# Altium schematic sheet Main1.SchDoc
size A3
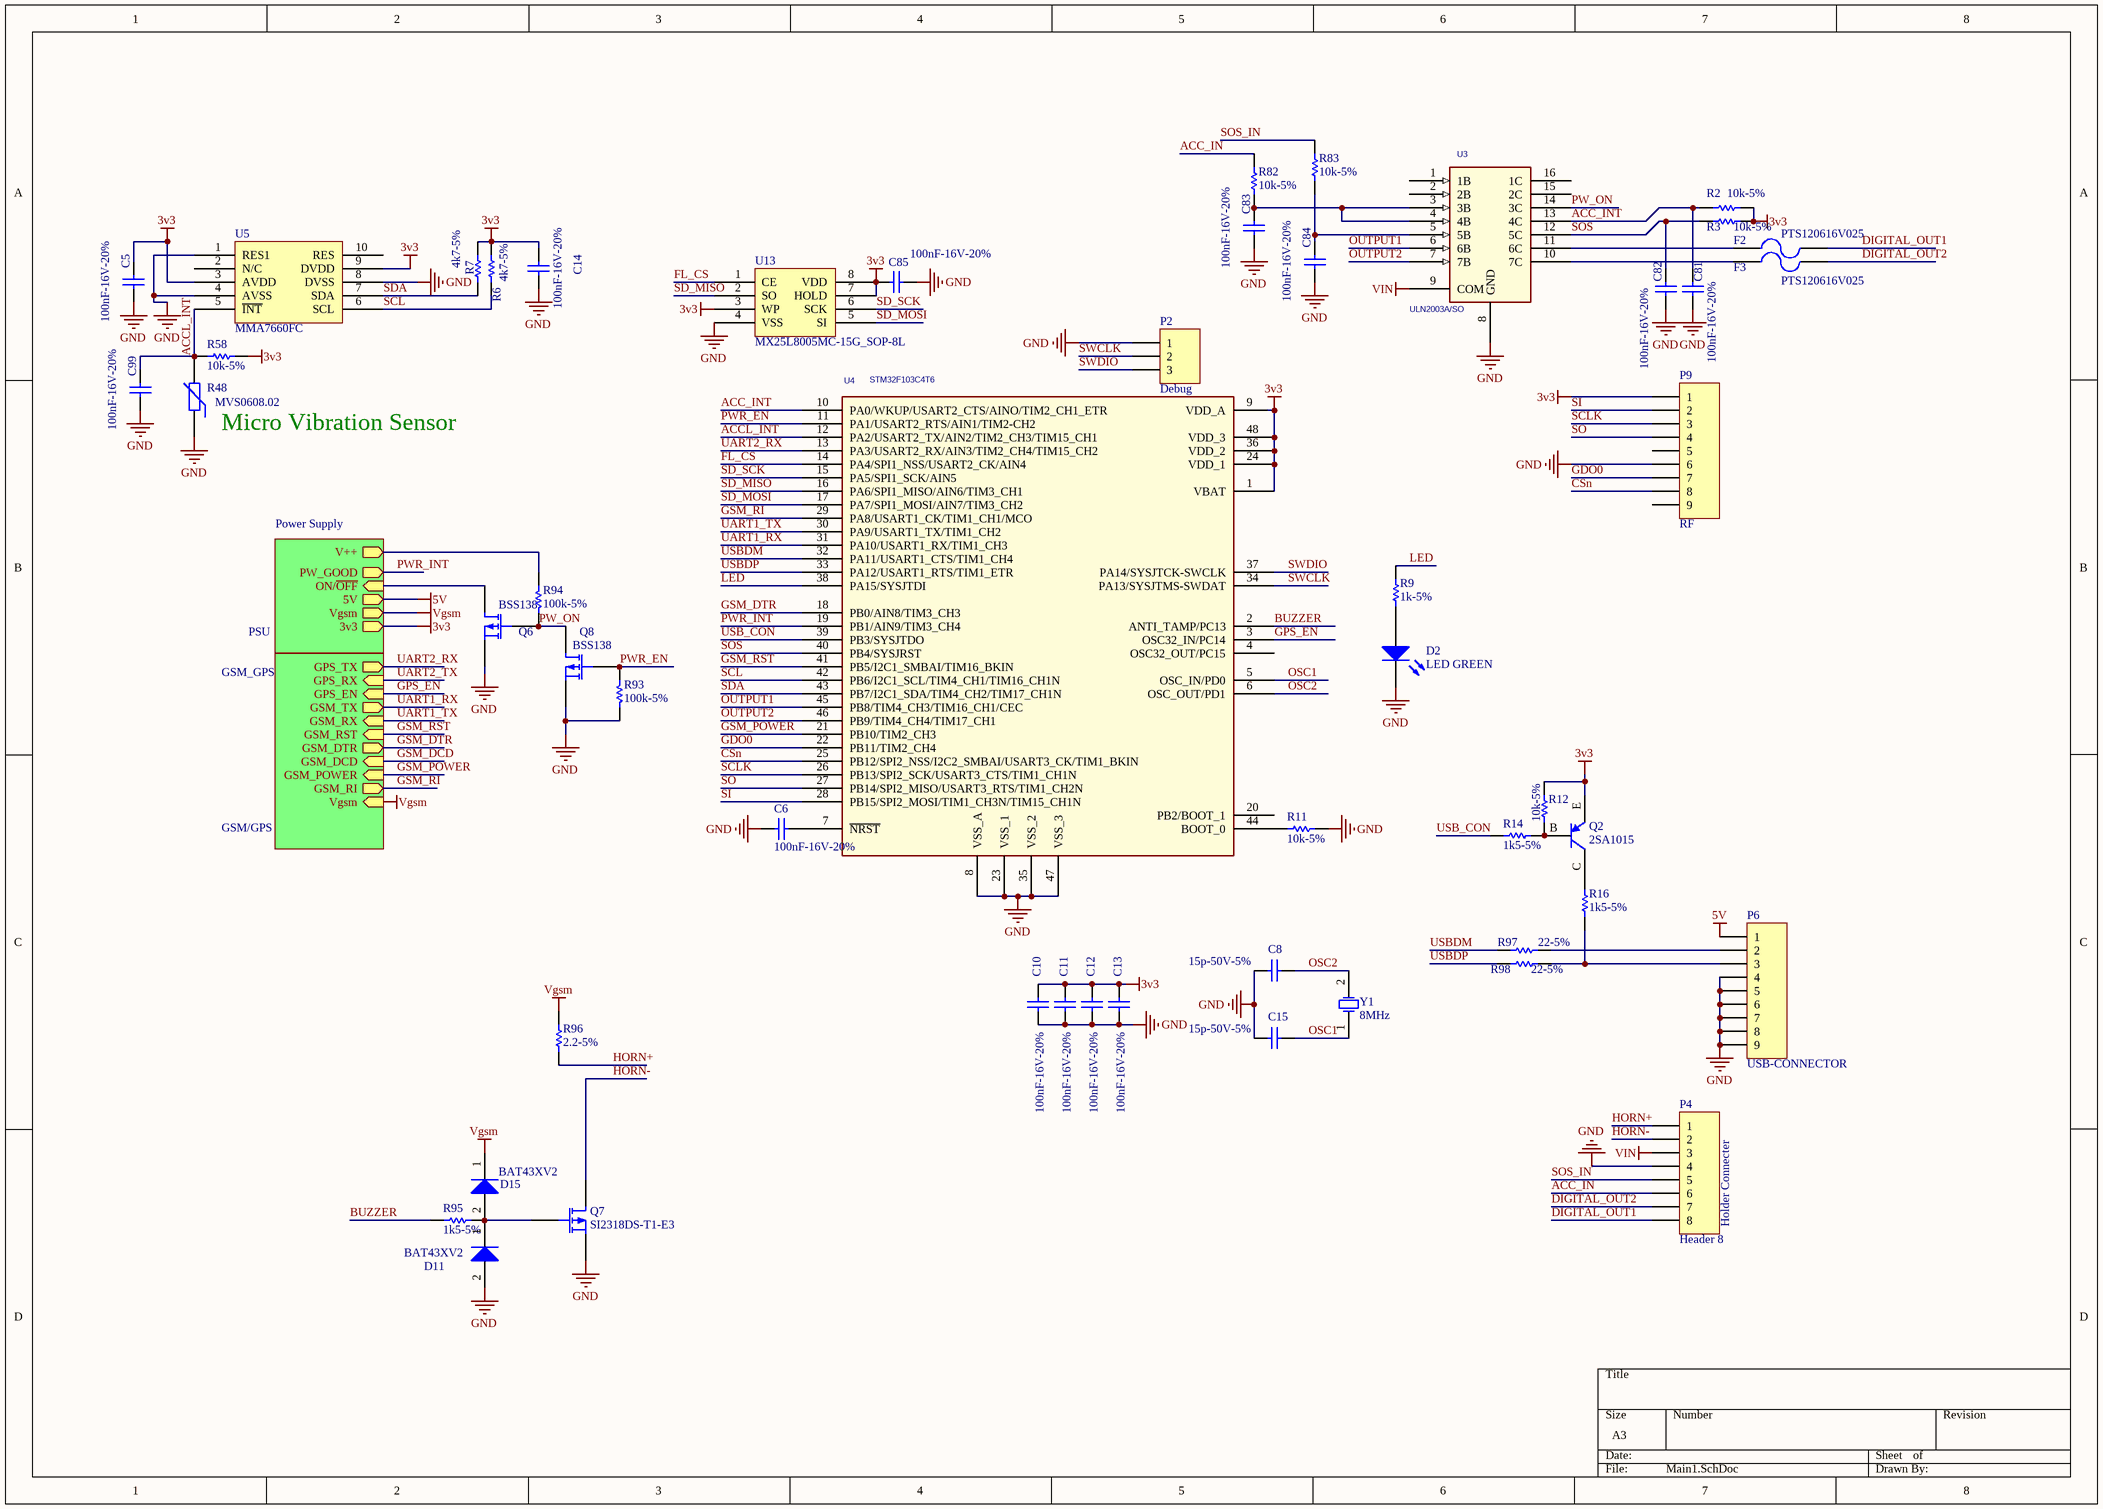
[diagram p0: Main1.SchDoc]

## Parts
C5  100nF-16V-20%  [C0402]
C6  100nF-16V-20%  [C0402]
C8  15p-50V-5%  [C0402]
C10  100nF-16V-20%  [C0402]
C11  100nF-16V-20%  [C0402]
C12  100nF-16V-20%  [C0402]
C13  100nF-16V-20%  [C0402]
C14  100nF-16V-20%  [C0402]
C15  15p-50V-5%  [C0402]
C81  100nF-16V-20%  [C0402]
C82  100nF-16V-20%  [C0402]
C83  100nF-16V-20%  [C0402]
C84  100nF-16V-20%  [C0402]
C85  100nF-16V-20%  [C0402]
C99  100nF-16V-20%  [C0402]
D2  LED GREEN  [LED0603-G]
D11  BAT43XV2  [BAT43XV2]
D15  BAT43XV2  [BAT43XV2]
F2  PTS120616V025  [PTC1206]
F3  PTS120616V025  [PTC1206]
P2  Debug  [HDR1X3]
P4  Header 8  [HDR1X8]
P6  USB-CONNECTOR  [USB MINI B RECEPTACLE-M]
P9  RF  [CC2500]
Q2  2SA1015  [SC-43-BCE]
Q6  BSS138  [SOT23-3]
Q7  SI2318DS-T1-E3  [SOT23-3]
Q8  BSS138  [SOT23-3]
R2  10k-5%  [R0402]
R3  10k-5%  [R0402]
R6  4k7-5%  [R0402]
R7  4k7-5%  [R0402]
R9  1k-5%  [R0402]
R11  10k-5%  [R0402]
R12  10k-5%  [R0402]
R14  1k5-5%  [R0402]
R16  1k5-5%  [R0402]
R48  MVS0608.02  [R1210]
R58  10k-5%  [R0402]
R82  10k-5%  [R0402]
R83  10k-5%  [R0402]
R93  100k-5%  [R0402]
R94  100k-5%  [R0402]
R95  1k5-5%  [R0402]
R96  2.2-5%  [R0805]
R97  22-5%  [R0402]
R98  22-5%  [R0402]
U3  ULN2003A/SO  [SO16-150mil]
U4  STM32F103C4T6  [TQFP-48-P0.5]
U5  MMA7660FC  [MMA7660FC]
U13  MX25L8005MC-15G_SOP-8L  [SO8-150mil]
Y1  8MHz  [HC49/US-SMD]

## Sub-sheets
GSM/GPS = GSM_GPS: GSM_POWER (in), GSM_RX (in), GSM_TX (out), GSM_DTR (out), Vgsm (in), GPS_RX (in), GPS_TX (out), GSM_DCD (in), GSM_RI (out), GPS_EN (in), GSM_RST (in)
Power Supply = PSU: Vgsm (out), 3v3 (out), 5V (out), ON/~{OFF} (in), PW_GOOD (out), V++ (out)

## Nets
3v3: C5.2 C10.1 C11.1 C12.1 C13.1 C14.2 C85.1 P9.1 Q2.E R2.2 R3.2 R6.2 R7.2 R12.2 R58.2 U4.1(VBAT) U4.9(VDD_A) U4.24(VDD_1) U4.36(VDD_2) U4.48(VDD_3) U5.3(AVDD) U5.9(DVDD) U13.3(WP) U13.7(HOLD) U13.8(VDD) ; sheet Power Supply/3v3
5V: P6.1 ; sheet Power Supply/5V
GND: C5.1 C6.2 C8.1 C10.2 C11.2 C12.2 C13.2 C14.1 C15.1 C81.1 C82.1 C83.1 C84.1 C85.2 C99.1 D2.2(K) D11.2(A) P2.1 P4.4 P6.4 P6.5 P6.6 P6.7 P6.8 P6.9 P9.6 Q6.2(S) Q7.2(S) Q8.2(S) R11.1 R48.1 R93.2 U3.8(GND) U4.8(VSS_A) U4.23(VSS_1) U4.35(VSS_2) U4.47(VSS_3) U5.1(RES1) U5.4(AVSS) U5.8(DVSS) U13.4(VSS)
Vgsm: D15.1(K) R96.1 ; sheet Power Supply/Vgsm, sheet GSM/GPS/Vgsm
VIN: P4.3 U3.9(COM)
ACC_IN: P4.6 R82.2
ACC_INT: C81.2 R2.1 U3.13(4C) U4.10(PA0/WKUP/USART2_CTS/AINO/TIM2_CH1_ETR)
ACCL_INT: C99.2 R48.2 R58.1 U4.12(PA2/USART2_TX/AIN2/TIM2_CH3/TIM15_CH1) U5.5(~{INT})
BUZZER: R95.2 U4.2(ANTI_TAMP/PC13)
CSn: P9.8 U4.25(PB12/SPI2_NSS/I2C2_SMBAI/USART3_CK/TIM1_BKIN)
DIGITAL_OUT1: F2.1 P4.8
DIGITAL_OUT2: F3.1 P4.7
FL_CS: U4.14(PA4/SPI1_NSS/USART2_CK/AIN4) U13.1(CE)
GDO0: P9.7 U4.22(PB11/TIM2_CH4)
GPS_EN: U4.3(OSC32_IN/PC14) ; sheet GSM/GPS/GPS_EN
GSM_DCD: sheet GSM/GPS/GSM_DCD
GSM_DTR: U4.18(PB0/AIN8/TIM3_CH3) ; sheet GSM/GPS/GSM_DTR
GSM_POWER: U4.21(PB10/TIM2_CH3) ; sheet GSM/GPS/GSM_POWER
GSM_RI: U4.29(PA8/USART1_CK/TIM1_CH1/MCO) ; sheet GSM/GPS/GSM_RI
GSM_RST: U4.41(PB5/I2C1_SMBAI/TIM16_BKIN) ; sheet GSM/GPS/GSM_RST
HORN+: P4.1 R96.2
HORN-: P4.2 Q7.3(D)
LED: R9.2 U4.38(PA15/SYSJTDI)
OSC1: C15.2 U4.5(OSC_IN/PD0) Y1.1(OSC1)
OSC2: C8.2 U4.6(OSC_OUT/PD1) Y1.2(OSC2)
OUTPUT1: U3.6(6B) U4.45(PB8/TIM4_CH3/TIM16_CH1/CEC)
OUTPUT2: U3.7(7B) U4.46(PB9/TIM4_CH4/TIM17_CH1)
PW_ON: Q6.1(G) Q8.3(D) R94.2 U3.14(3C)
PWR_EN: Q8.1(G) R93.1 U4.11(PA1/USART2_RTS/AIN1/TIM2-CH2)
PWR_INT: U4.19(PB1/AIN9/TIM3_CH4) ; sheet Power Supply/PW_GOOD
SCL: R6.1 U4.42(PB6/I2C1_SCL/TIM4_CH1/TIM16_CH1N) U5.6(SCL)
SCLK: P9.3 U4.26(PB13/SPI2_SCK/USART3_CTS/TIM1_CH1N)
SD_MISO: U4.16(PA6/SPI1_MISO/AIN6/TIM3_CH1) U13.2(SO)
SD_MOSI: U4.17(PA7/SPI1_MOSI/AIN7/TIM3_CH2) U13.5(SI)
SD_SCK: U4.15(PA5/SPI1_SCK/AIN5) U13.6(SCK)
SDA: R7.1 U4.43(PB7/I2C1_SDA/TIM4_CH2/TIM17_CH1N) U5.7(SDA)
SI: P9.2 U4.28(PB15/SPI2_MOSI/TIM1_CH3N/TIM15_CH1N)
SO: P9.4 U4.27(PB14/SPI2_MISO/USART3_RTS/TIM1_CH2N)
SOS: C82.2 R3.1 U3.12(5C) U4.40(PB4/SYSJRST)
SOS_IN: P4.5 R83.2
SWCLK: P2.2 U4.34(PA13/SYSJTMS-SWDAT)
SWDIO: P2.3 U4.37(PA14/SYSJTCK-SWCLK)
UART1_RX: U4.31(PA10/USART1_RX/TIM1_CH3) ; sheet GSM/GPS/GSM_TX
UART1_TX: U4.30(PA9/USART1_TX/TIM1_CH2) ; sheet GSM/GPS/GSM_RX
UART2_RX: U4.13(PA3/USART2_RX/AIN3/TIM2_CH4/TIM15_CH2) ; sheet GSM/GPS/GPS_TX
UART2_TX: sheet GSM/GPS/GPS_RX
USB_CON: R14.2 U4.39(PB3/SYSJTDO)
USBDM: R97.1 U4.32(PA11/USART1_CTS/TIM1_CH4)
USBDP: R98.1 U4.33(PA12/USART1_RTS/TIM1_ETR)
NetC6_1: C6.1 U4.7(~{NRST})
NetC83_2: C83.2 R82.1 U3.3(3B) U3.4(4B)
NetC84_2: C84.2 R83.1 U3.5(5B)
NetD2_1: D2.1(A) R9.1
NetD11_1: D11.1(K) D15.2(A) Q7.1(G) R95.1
NetF2_2: F2.2 U3.11(6C)
NetF3_2: F3.2 U3.10(7C)
NetP6_2: P6.2 R97.2
NetP6_3: P6.3 R16.2 R98.2
NetQ2_B: Q2.B R12.1 R14.1
NetQ2_C: Q2.C R16.1
NetQ6_3: Q6.3(D) ; sheet Power Supply/ON/~{OFF}
NetR11_2: R11.2 U4.44(BOOT_0)
NetR94_1: R94.1 ; sheet Power Supply/V++

Not connected (* = marked no-connect by the designer): P9 5 9; U3 1(1B) 2(2B) 15(2C) 16(1C); U4 4(OSC32_OUT/PC15) 20(PB2/BOOT_1); U5 2(N/C) 10(RES)

## Notes on the sheet
- (near R48) Micro Vibration Sensor
- (near P4) Holder Connecter

## Library data of the parts
C5 C6 C10-C14 C81-C85 C99 = Cap: CAP CER 0.1UF 16V Y5V 0402; Manufacturer: Yageo; Manufacturer Part Number: CC0402ZRY5V7BB104; Published: 8-Jun-2000; LatestRevisionDate: 17-Jul-2002; LatestRevisionNote: Re-released for DXP Platform.; PackageReference: C0402; Publisher: Altium Limited; Value: 100nF-16V-20%; Digi-Key Part Number: 311-1047-1-ND; Unit Price: 0.00250
C8 C15 = Cap: CAP CER 15PF 50V 5% NPO 0402; Manufacturer: Yageo; Manufacturer Part Number: CC0402JRNPO9BN150; Published: 8-Jun-2000; LatestRevisionDate: 17-Jul-2002; LatestRevisionNote: Re-released for DXP Platform.; PackageReference: C0402; Publisher: Altium Limited; Value: 15p-50V-5%; Digi-Key Part Number: 311-1017-1-ND; Unit Price: 0.00270
D2 = LED2: LED GREEN CLEAR THIN 0603 SMD; Manufacturer: Lite-On Inc; Manufacturer Part Number: LTST-C191KGKT; Published: 8-Jun-2000; LatestRevisionDate: 17-Jul-2002; LatestRevisionNote: Re-released for DXP Platform.; PackageVersion: Feb-2002; PackageReference: 3.2X1.6X1.1; Publisher: Altium Limited; Digi-Key Part Number: 160-1446-2-ND; Unit Price: 0.03780; Value: LED GREEN
D11 D15 = Diode: Diode Type SMD; Manufacturer: Fairchild Semiconductor; Published: 8-Jun-2000; LatestRevisionDate: 17-Jul-2002; LatestRevisionNote: Re-released for DXP Platform.; PackageVersion: Sep-1996; PackageReference: SMC; Publisher: Altium Limited; Code_JEDEC: DO-214-AB; Value: BAT43XV2; Digi-Key Part Number: BAT43XV2CT-ND; Manufacturer Part Number: BAT43XV2; Unit Price: 0.01822
F2 F3 = Fuse 2: PTC RESETTABLE SMD 1206 16V .25A; Manufacturer: Cooper Bussmann; Published: 8-Jun-2000; LatestRevisionDate: 17-Jul-2002; LatestRevisionNote: Re-released for DXP Platform.; PackageReference: PIN-W2/E2.8; Publisher: Altium Limited; Digi-Key Part Number: 283-3137-2-ND; Manufacturer Part Number: 120616V025; Unit Price: 0.12375; Value: PTS120616V025; tme part: SMD1815P050TF
P2 = Header 3: Header, 3-Pin; LatestRevisionDate: 17-Jul-2002; LatestRevisionNote: Re-released for DXP Platform.; Publisher: Altium Limited
P4 = Header 8: Header, 8-Pin; LatestRevisionDate: 17-Jul-2002; LatestRevisionNote: Re-released for DXP Platform.; Publisher: Altium Limited
P6 = Header 9: CONN RCPT USB MINI B R/A SMD; Manufacturer: Hirose Electric Co Ltd; Manufacturer Part Number: UX60SC-MB-5ST(80); LatestRevisionDate: 17-Jul-2002; LatestRevisionNote: Re-released for DXP Platform.; Publisher: Altium Limited; Digi-Key Part Number: H11671TR-ND; Unit Price: 0.30000
P9 = MHDR1X9: Header, 9-Pin; LatestRevisionDate: 17-Jul-2002; LatestRevisionNote: Re-released for DXP Platform.; Publisher: Altium Limited; link: http://www.aliexpress.com/store/product/transcevier-module-CC2500-distance-50-60-meters/605000_525916173.html; Web: http://www.aliexpress.com/store/product/Low-consumption-and-low-cost-2-4G-RF-wireless-module-CC2500/605000_378601194.html
Q2 = PNP Transistor: Manufacturer: Toshiba; Manufacturer Part Number: 2SA1015LT1-BA; Unit Price: 0.02; Web: http://tme.vn/Product.aspx?id=414#page=pro_info
Q6 Q8 = MOSFET-P: MOSFET P-CH 50V 130MA SOT23-3; Manufacturer: Diodes Inc; Manufacturer Part Number: BSS84-7-F; Published: 8-Jun-2000; LatestRevisionDate: 17-Jul-2002; LatestRevisionNote: Re-released for DXP Platform.; PackageVersion: 1995/1996; PackageReference: E3; Publisher: Altium Limited; Digi-Key Part Number: BSS84-FDITR-ND; Unit Price: 0.06000
Q7 = MOSFET-P: MOSFET N-CH 40V 3A SOT23-3; Manufacturer: Vishay Siliconix; Published: 8-Jun-2000; LatestRevisionDate: 17-Jul-2002; LatestRevisionNote: Re-released for DXP Platform.; PackageVersion: 1995/1996; PackageReference: E3; Publisher: Altium Limited; Digi-Key Part Number: SI2318DS-T1-E3TR-ND; Manufacturer Part Number: SI2318DS-T1-E3; Unit Price: 0.17825
R2 R3 R11 R12 R58 R82 R83 = Res1: RES 10K OHM 1/16W 5% 0402 SMD; Manufacturer: Yageo; Manufacturer Part Number: RC0402JR-0710KL; Description: RES 10K OHM 1/10W 5% 0603 SMD; Published: 8-Jun-2000; LatestRevisionDate: 17-Jul-2002; LatestRevisionNote: Re-released for DXP Platform.; PackageReference: R0603; Publisher: Altium Limited; Value: 10k-5%; Digi-Key Part Number: 311-10KJRCT-ND; Unit Price: 0.00178
R6 R7 = Res1: RES 4.7K OHM 1/16W 5% 0402 SMD; Manufacturer: Yageo; Manufacturer Part Number: RC0402JR-074K7L; Description: RES 10K OHM 1/10W 5% 0603 SMD; Published: 8-Jun-2000; LatestRevisionDate: 17-Jul-2002; LatestRevisionNote: Re-released for DXP Platform.; PackageReference: R0603; Publisher: Altium Limited; Value: 4k7-5%; Digi-Key Part Number: 311-4.7KJRCT-ND; Unit Price: 0.00178
R9 = Res1: RES 1.0K OHM 1/16W 5% 0402 SMD; Manufacturer: Yageo; Manufacturer Part Number: RC0402JR-071KL; Published: 8-Jun-2000; LatestRevisionDate: 17-Jul-2002; LatestRevisionNote: Re-released for DXP Platform.; PackageReference: R0603; Publisher: Altium Limited; Value: 1k-5%; Digi-Key Part Number: 311-1.0KJRCT-ND; Unit Price: 0.00178
R14 R16 R95 = Res1: RES 1.5K OHM 1/16W 5% 0402 SMD; Manufacturer: Yageo; Manufacturer Part Number: RC0402JR-071K5L; Published: 8-Jun-2000; LatestRevisionDate: 17-Jul-2002; LatestRevisionNote: Re-released for DXP Platform.; PackageReference: R0603; Publisher: Altium Limited; Value: 1k5-5%; Digi-Key Part Number: 311-1.5KJRCT-ND; Unit Price: 0.00207
R48 = Res Varistor: Micro Vibration Sensor; Manufacturer: Tyrone; Published: 24-Mar-1999; LatestRevisionDate: 29-May-2009; LatestRevisionNote: IPC-7351 Footprint Added.; PackageVersion: Mar-2003; PackageReference: 6-0805; Publisher: Altium Limited; PackageDescription: Chip Resistor 0805 Case Size; Code_IPC: RESC2012
R93 R94 = Res1: RES 100K OHM 1/16W 5% 0402 SMD; Manufacturer: Yageo; Manufacturer Part Number: RC0402JR-07100KL; Published: 8-Jun-2000; LatestRevisionDate: 17-Jul-2002; LatestRevisionNote: Re-released for DXP Platform.; PackageReference: R0402; Publisher: Altium Limited; Value: 100k-5%; Digi-Key Part Number: 311-100KJRCT-ND; Unit Price: 0.00171
R96 = Res1: RES 2.2 OHM 1/16W 5% 0402 SMD; Manufacturer: Yageo; Manufacturer Part Number: RC0402JR-072R2L; Published: 8-Jun-2000; LatestRevisionDate: 17-Jul-2002; LatestRevisionNote: Re-released for DXP Platform.; PackageReference: R0603; Publisher: Altium Limited; Value: 2.2-5%; Digi-Key Part Number: 311-2.2JRCT-ND; Unit Price: 0.00178
R97 R98 = Res1: RES 22 OHM 1/16W 5% 0402 SMD; Manufacturer: Yageo; Manufacturer Part Number: RC0402JR-0722RL; Published: 8-Jun-2000; LatestRevisionDate: 17-Jul-2002; LatestRevisionNote: Re-released for DXP Platform.; PackageReference: R0402; Publisher: Altium Limited; Value: 22-5%; Digi-Key Part Number: 311-22JRCT-ND; Unit Price: 0.00178
U3 = ULN2003A/SO_0: IC DARL TRANS ARRAY 16-SOIC; Manufacturer Part Number: ULN2003ADR; Manufacturer: Texas Instruments; Digi-Key Part Number: 296-1368-2-ND; Unit Price: 0.144
U4 = ATmega128_4: MCU ARM 64KB FLASH MEM 48-LQFP; Manufacturer: STMicroelectronics; Manufacturer Part Number: STM32F103C8T6; Digi-Key Part Number: 497-6063-ND; Unit Price: 1.5
U5 = MMA7660FC: ACCELEROMETER 3X3 DGTL 10-DFN; Manufacturer: Freescale Semiconductor; Manufacturer Part Number: MMA7660FCT; Unit Price: 0.67000; Digi-Key Part Number: MMA7660FCT-ND
U13 = FlashIC: Manufacturer: Tyrone
Y1 = XTAL: CRYSTAL 8.000MHZ 18PF SMD; Manufacturer: Abracon Corporation; Manufacturer Part Number: ABLS-8.000MHZ-B2-T; Published: 8-Jun-2000; LatestRevisionDate: 17-Jul-2002; LatestRevisionNote: Re-released for DXP Platform.; PackageReference: R38; Publisher: Altium Limited; Digi-Key Part Number: 535-9089-1-ND; Unit Price: 0.11